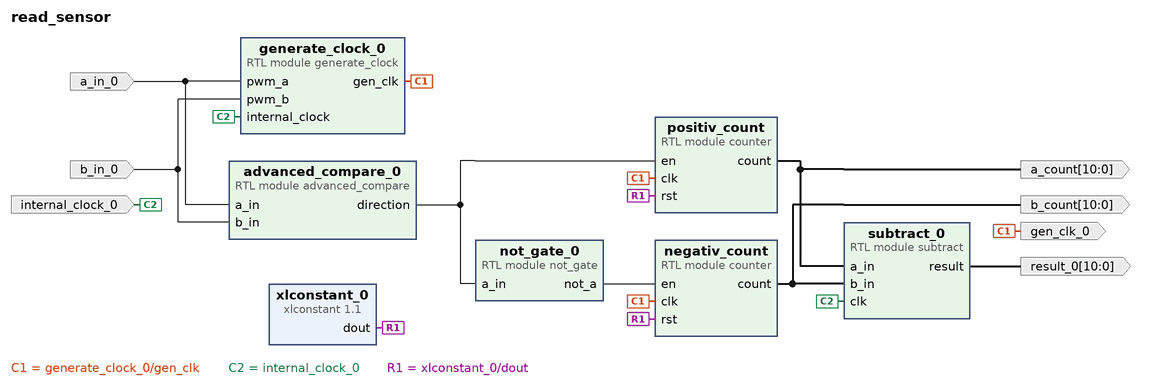
[diagram p0: block diagram of the top level]
# Vivado block design read_sensor, xc7z020clg400-1, Vivado 2024.2
create_bd_design read_sensor

create_bd_port -dir I a_in_0
create_bd_port -dir I b_in_0
create_bd_port -dir I -type clk internal_clock_0
create_bd_port -dir O -type clk gen_clk_0
create_bd_port -dir O -from 10 -to 0 result_0
create_bd_port -dir O -from 10 -to 0 a_count
create_bd_port -dir O -from 10 -to 0 b_count

create_bd_cell -type module -reference advanced_compare advanced_compare_0
create_bd_cell -type module -reference not_gate not_gate_0
create_bd_cell -type module -reference generate_clock generate_clock_0
create_bd_cell -type module -reference counter negativ_count
set_property -dict {CONFIG.n_bits 11} [get_bd_cells negativ_count]
create_bd_cell -type ip -vlnv xilinx.com:ip:xlconstant:1.1 xlconstant_0
set_property -dict {CONFIG.CONST_VAL 0} [get_bd_cells xlconstant_0]
create_bd_cell -type module -reference counter positiv_count
set_property -dict {CONFIG.n_bits 11} [get_bd_cells positiv_count]
create_bd_cell -type module -reference subtract subtract_0
set_property -dict {CONFIG.n_bits 11} [get_bd_cells subtract_0]

# ---- connections ----

connect_bd_net -net a_in_0_1 [get_bd_ports a_in_0] [get_bd_pins advanced_compare_0/a_in] [get_bd_pins generate_clock_0/pwm_a]
connect_bd_net [get_bd_pins advanced_compare_0/direction] [get_bd_pins positiv_count/en] [get_bd_pins not_gate_0/a_in]
connect_bd_net -net b_in_0_1 [get_bd_ports b_in_0] [get_bd_pins advanced_compare_0/b_in] [get_bd_pins generate_clock_0/pwm_b]
connect_bd_net [get_bd_pins generate_clock_0/gen_clk] [get_bd_ports gen_clk_0] [get_bd_pins negativ_count/clk] [get_bd_pins positiv_count/clk]
connect_bd_net -net internal_clock_0_1 [get_bd_ports internal_clock_0] [get_bd_pins generate_clock_0/internal_clock] [get_bd_pins subtract_0/clk]
connect_bd_net [get_bd_pins negativ_count/count] [get_bd_ports b_count] [get_bd_pins subtract_0/b_in]
connect_bd_net [get_bd_pins not_gate_0/not_a] [get_bd_pins negativ_count/en]
connect_bd_net [get_bd_pins positiv_count/count] [get_bd_ports a_count] [get_bd_pins subtract_0/a_in]
connect_bd_net [get_bd_pins subtract_0/result] [get_bd_ports result_0]
connect_bd_net [get_bd_pins xlconstant_0/dout] [get_bd_pins negativ_count/rst] [get_bd_pins positiv_count/rst]

validate_bd_design
save_bd_design
